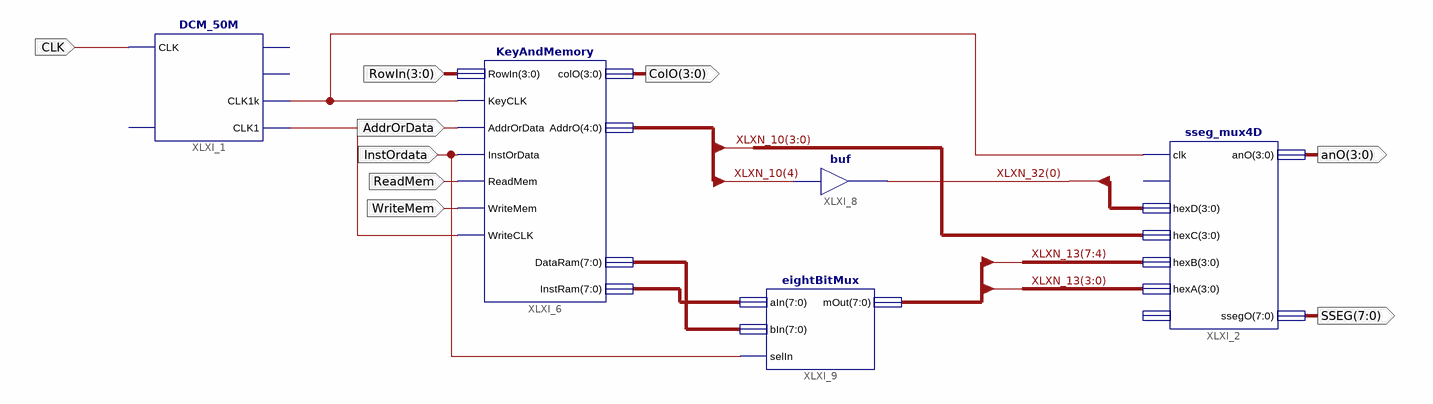
[diagram p0: schematic sheet 1]
// Xilinx ISE schematic TestArea.sch (spartan3e) as structural Verilog: 5 symbols, 9 ports
module TestArea (
  input  CLK,
  input  AddrOrData,
  input  ReadMem,
  input  WriteMem,
  input  [3:0] RowIn,
  input  InstOrdata,
  output [3:0] ColO,
  output [3:0] anO,
  output [7:0] SSEG
);

  wire XLXN_1, XLXN_43;
  wire [3:0] XLXN_32;
  wire [4:0] XLXN_10;
  wire [7:0] XLXN_13, XLXN_36, XLXN_37;

  DCM_50M XLXI_1 (.CLK(CLK), .CLK1k(XLXN_1), .CLK1(XLXN_43));  // open: RST, CLK1M, CLK10k
  sseg_mux4D XLXI_2 (
    .clk(XLXN_1), .hexD(XLXN_32), .hexC(XLXN_10[3:0]), .hexB(XLXN_13[7:4]), .hexA(XLXN_13[3:0]), .anO(anO),
    .ssegO(SSEG));  // open: rb_in, dp_in
  KeyAndMemory XLXI_6 (
    .RowIn(RowIn), .KeyCLK(XLXN_1), .AddrOrData(AddrOrData), .InstOrData(InstOrdata), .ReadMem(ReadMem),
    .WriteMem(WriteMem), .WriteCLK(XLXN_43), .colO(ColO), .AddrO(XLXN_10), .DataRam(XLXN_36),
    .InstRam(XLXN_37));
  buf XLXI_8 (XLXN_32[0], XLXN_10[4]);
  eightBitMux XLXI_9 (.aIn(XLXN_37), .bIn(XLXN_36), .selIn(InstOrdata), .mOut(XLXN_13));
endmodule
